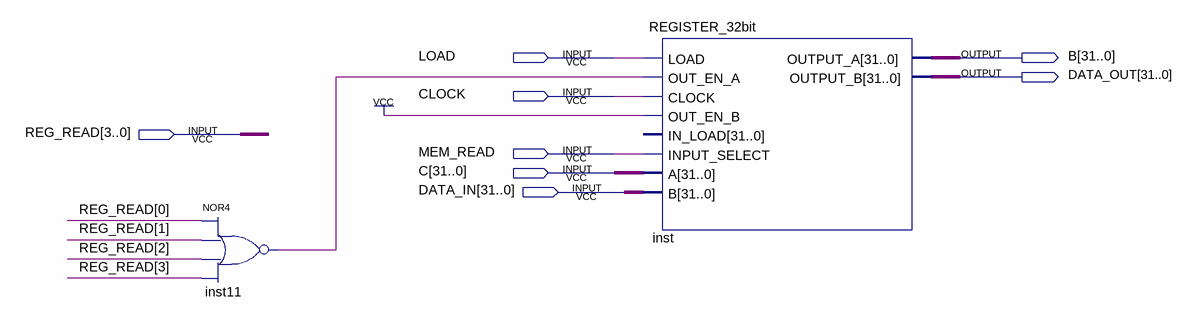
[diagram p0: schematic sheet]
// Quartus schematic MDR.bdf as structural Verilog: 2 symbols, 8 pins
module MDR (
  input  LOAD,
  input  CLOCK,
  input  [3:0] REG_READ,
  input  MEM_READ,
  input  [31:0] C,
  input  [31:0] DATA_IN,
  output [31:0] B,
  output [31:0] DATA_OUT
);

  wire inst11_out;

  nor inst11 (inst11_out, REG_READ[0], REG_READ[1], REG_READ[2], REG_READ[3]);
  REGISTER_32bit inst (
    .LOAD(LOAD), .OUT_EN_A(inst11_out), .CLOCK(CLOCK), .OUT_EN_B(1'b1), .INPUT_SELECT(MEM_READ), .A(C),
    .B(DATA_IN), .OUTPUT_A(B), .OUTPUT_B(DATA_OUT));  // open: IN_LOAD
endmodule
